# EAGLE design attinier85-light-sensor-shield-mk-2.0 (EAGLE 6.5.0)
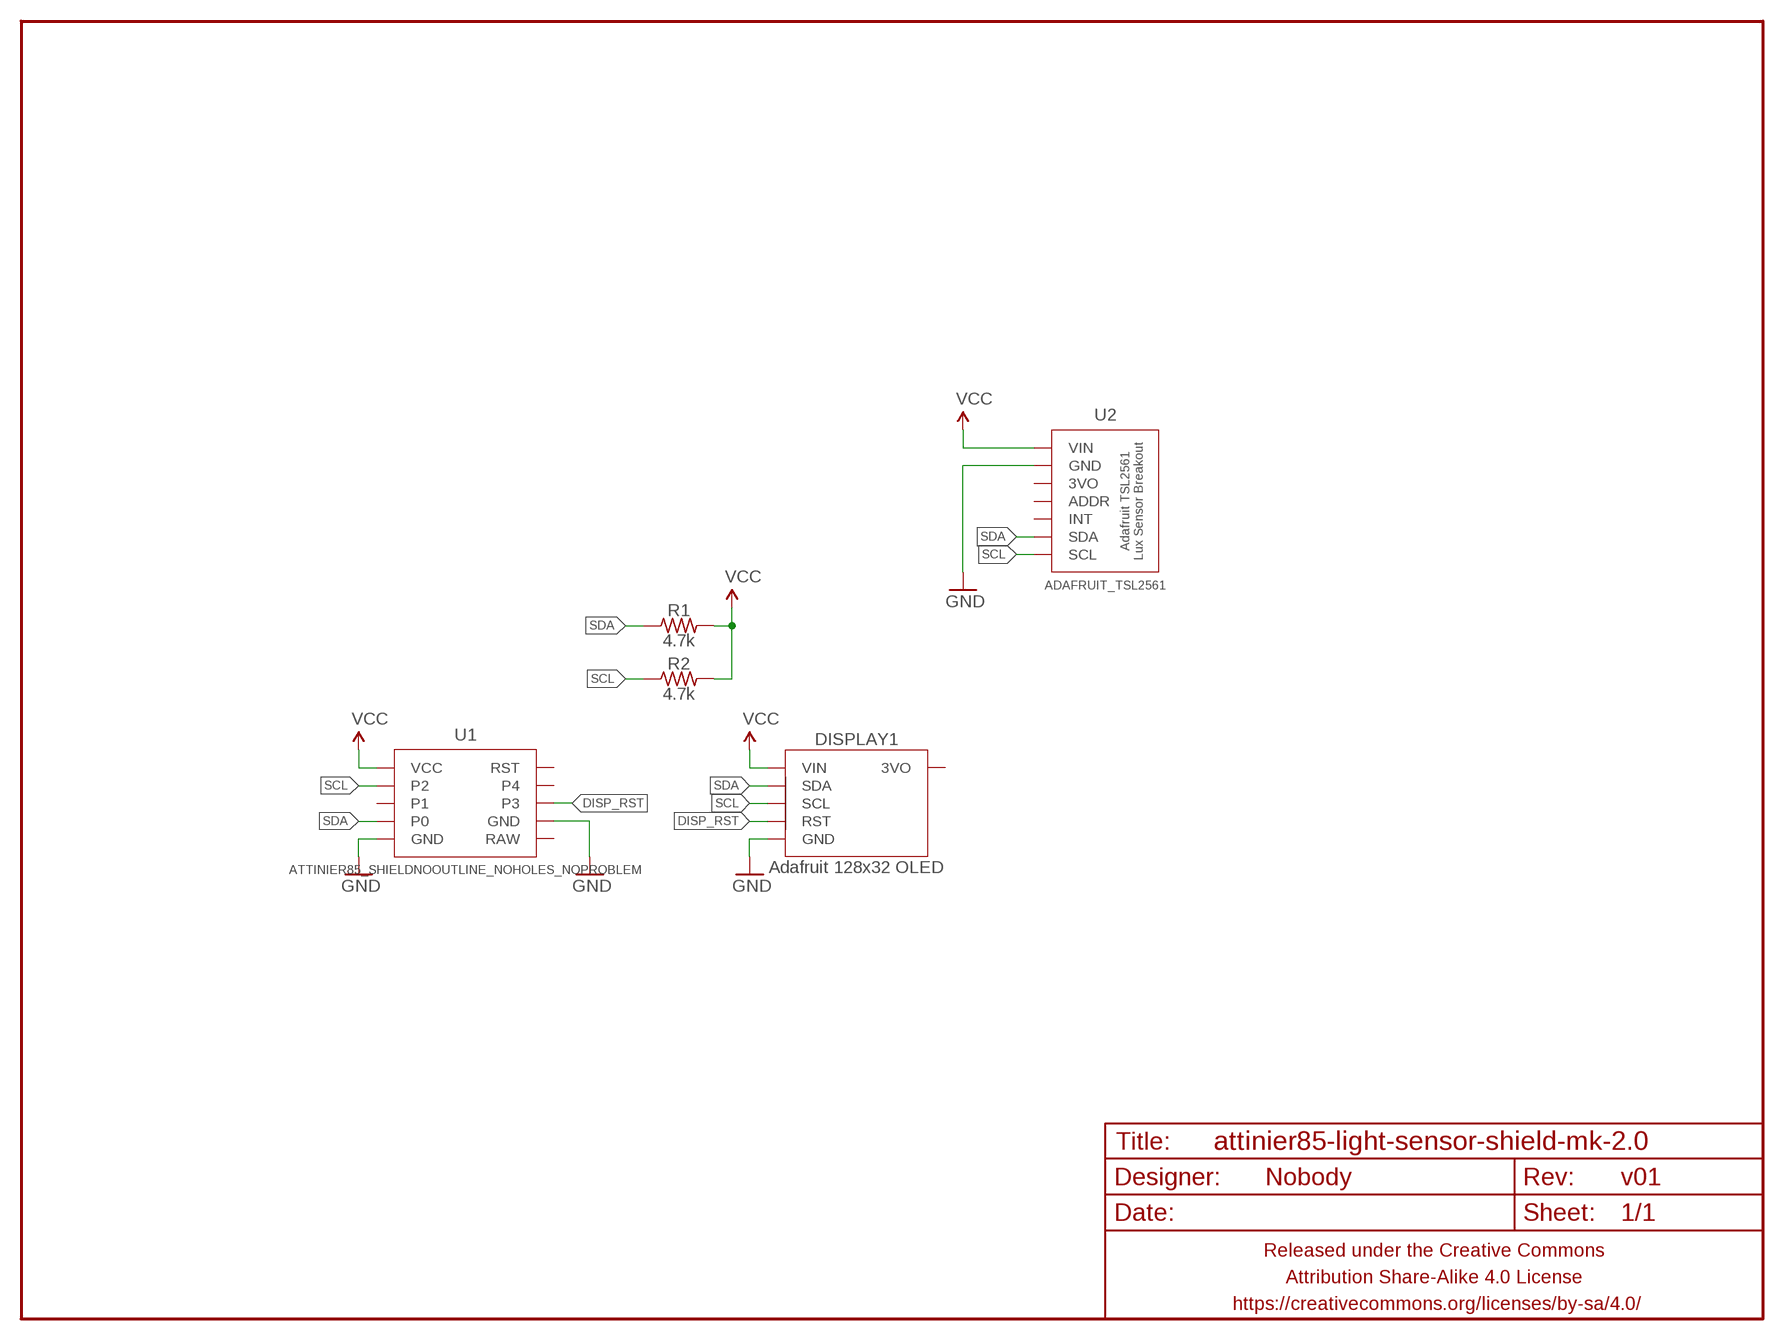
[diagram p0: schematic, sheet 1]

## Parts
DISPLAY1  Adafruit 128x32 OLED  ADAFRUIT_128X32_OLED_I2CNOTITLE  [ADAFRUIT_128X32_OLED_I2C_CLOSER_NOTITLE]
FRAME1  FRAME-LETTERNO_PACKAGE  [DUMMY]
R1  4.7k  RESISTORPTH-AXIAL-7.62MM  [RESISTOR-AXIAL-PTH-7.62MM]
R2  4.7k  RESISTORPTH-AXIAL-7.62MM  [RESISTOR-AXIAL-PTH-7.62MM]
U1  ATTINIER85_SHIELDNOOUTLINE_NOHOLES_NOPROBLEM  [ATTINIER_SHIELD_NOOUTLINE_NOHOLES]
U2  ADAFRUIT_TSL2561  [ADAFRUIT_TSL2561]

## Nets
DISP_RST: DISPLAY1.RST U1.3
GND: DISPLAY1.GND U1.GND@1(GND) U1.GND@2(GND) U2.GND
SCL: DISPLAY1.SCL R2.P$1 U1.2 U2.SCL
SDA: DISPLAY1.SDA R1.P$1 U1.0 U2.SDA
VCC: DISPLAY1.VIN R1.P$2 R2.P$2 U1.VCC U2.VIN
Unconnected: DISPLAY1.3VO U1.1 U1.4 U1.RAW U1.RST U2.3VO U2.ADDR U2.INT

## Library data of the parts
DISPLAY1 = A_butts:ADAFRUIT_128X32_OLED_I2C
FRAME1 = A_butts:FRAME-LETTER: Schematic Frame Standard 8.5x11 US Letter frame; DESIGNER: Nobody; VERSION: v01
R1 R2 = A_butts:RESISTOR: RESISTOR, American symbol
U1 = A_butts:ATTINIER85_SHIELD
U2 = A_butts:ADAFRUIT_TSL2561

## Board
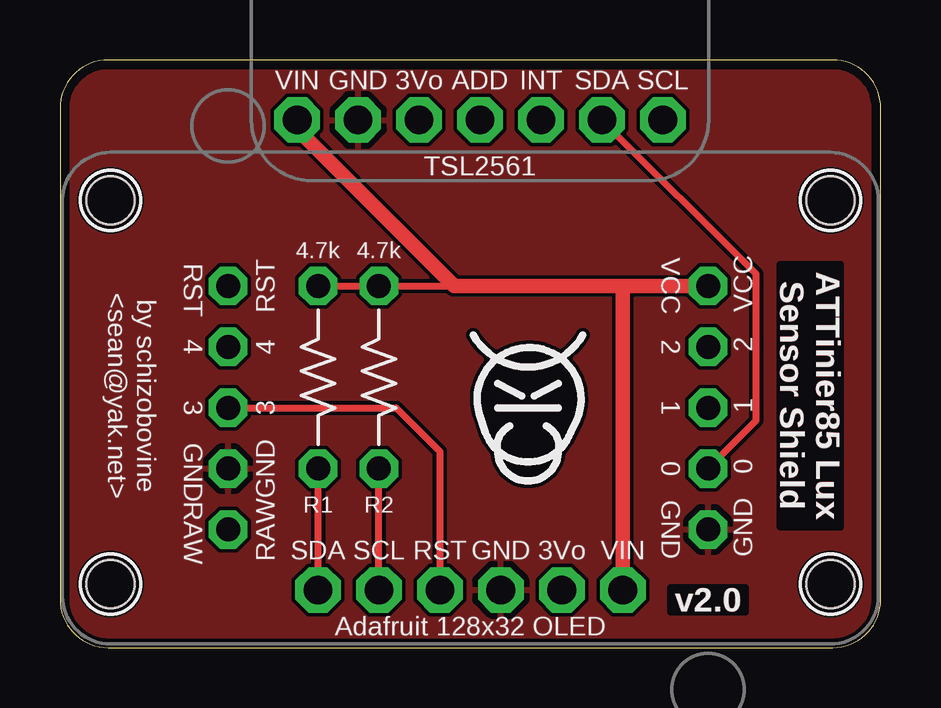
[diagram p1: board, top side]
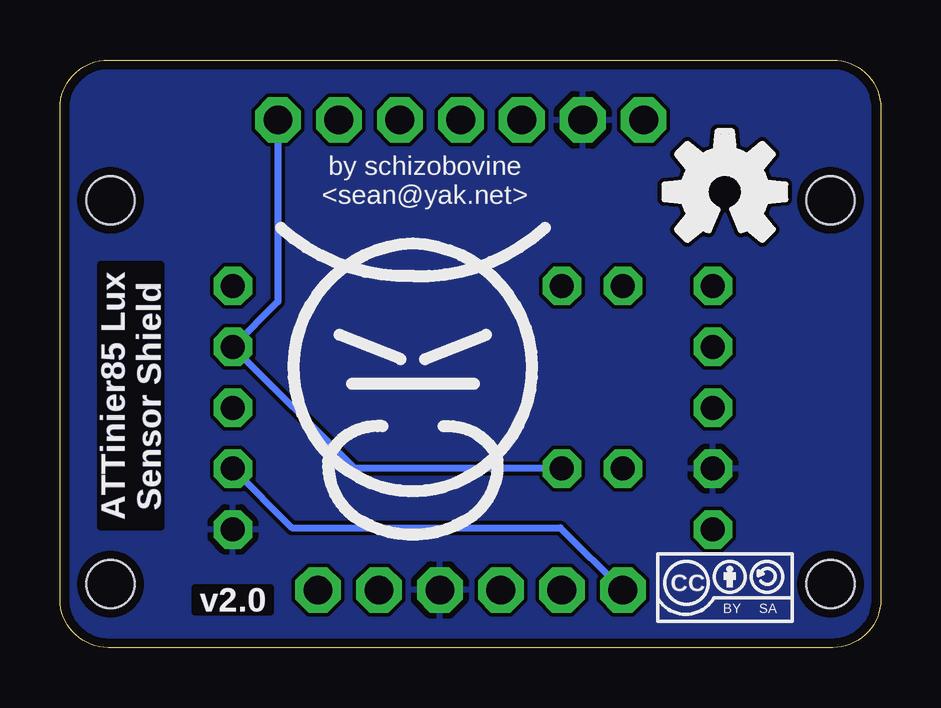
[diagram p2: board, bottom side, seen from below]

Size 34.2 x 24.5 mm. Coordinates in mm from the lower left corner, seen from the top.
Outline: 34.2,2 34.2,22.5 arc90 32.2,24.5 2,24.5 arc90 0,22.5 0,2 arc90 2,0 32.2,0 arc90 34.2,2
Copper layers (1*16): Top 0.0356mm / dielectric 1.5011mm / Bottom 0.0356mm
Design rules "LaenPCBOrder_2": minimum track width 6mil, minimum drill 13mil, track to track 6mil, track to pad 6mil, pad to pad 6mil, via to via 6mil, smd to smd 6mil, copper to edge 15mil, drill to drill 6mil, minimum pad ring 7mil, minimum via ring 7mil, stop-mask expansion 3mil, vias tented up to drill 20mil, thermal gap 10mil

### Footprints (pad centres in the part's own frame; a part is rotated, then mirrored left to right if it is on the bottom)
ADAFRUIT_128X32_OLED_I2C_CLOSER_NOTITLE = drill 1.2 pad 1.9 octagon: 3VO 3.81,0; GND 1.27,0; RST -1.27,0; SCL -3.81,0; SDA -6.35,0; VIN 6.35,0 | hole 2: -15,16.246; 15,16.246; -15,0.246; 15,0.246
RESISTOR-AXIAL-PTH-7.62MM = drill 1 pad 1.6 octagon: P$1 -3.81,0; P$2 3.81,0
ATTINIER_SHIELD_NOOUTLINE_NOHOLES = drill 1 pad 1.6 octagon: 0 10,-2.54; 1 10,0; 2 10,2.54; 3 -10,0; 4 -10,2.54; GND@1 -10,-2.54; GND@2 10,-5.08; RAW -10,-5.08; RST -10,5.08; VCC 10,5.08
ADAFRUIT_TSL2561 = drill 1.2 pad 1.9 octagon: 3VO -2.54,0; ADDR 0,0; GND -5.08,0; INT 2.54,0; SCL 7.62,0; SDA 5.08,0; VIN -7.62,0

### Placement (x,y rotation side)
DISPLAY1  17.1,2.4 0 top
FRAME1  0,0 0 top
R1  10.75,11.27 90 top
R2  13.29,11.27 90 top
U1  17,10 0 top
U2  17.5,22 0 top
U$1  [COW]  19.5,10.5 0 bottom
U$2  [CC-BY-SA-4.0-NO-URL]  6.5,2.5 0 bottom
U$3  [OSHWLOGO_TOP_0.2]  6.5,19 0 bottom
U$5  [COW_SMALL_METAL_NOTEXT]  19.5,10.5 0 top

### Tracks (layer width: path | path; a pad name or v marks a point on that pad's centre or on a via)
DISP_RST
  Top 0.3: U1.3 14,10 15.83,8.17 DISPLAY1.RST
GND
  pour Top: -0.1,-0.1 -0.1,24.6 34.3,24.6 34.3,-0.1
  pour Bottom: -0.1,-0.1 -0.1,24.6 34.3,24.6 34.3,-0.1
SCL
  Top 0.3: DISPLAY1.SCL R2.P$1
  Bottom 0.3: R2.P$1 21.92,7.46 U1.2 25.12,14.42 U2.SCL
SDA
  Top 0.3: DISPLAY1.SDA R1.P$1 | U1.0 29,9.46 29,15.58 U2.SDA
  Bottom 0.3: U1.0 24.54,5 13.35,5 DISPLAY1.SDA
VCC
  Top 0.3: R1.P$2 R2.P$2 17,15.08
  Top 0.6: DISPLAY1.VIN 23.45,15.08 | 23.45,15.08 U1.VCC | 23.45,15.08 17.5,15.08 17,15.08 16.8,15.08 16.42,15.08 9.88,21.62 U2.VIN

### Text on the board
Top: ATTinier85 Lux / Sensor Shield
Bottom: ATTinier85 Lux / Sensor Shield
tPlace: TSL2561 | by schizobovine / <sean@yak.net> | ATTinier85 Lux / Sensor Shield | Adafruit 128x32 OLED
bPlace: by schizobovine / <sean@yak.net> | ATTinier85 Lux / Sensor Shield